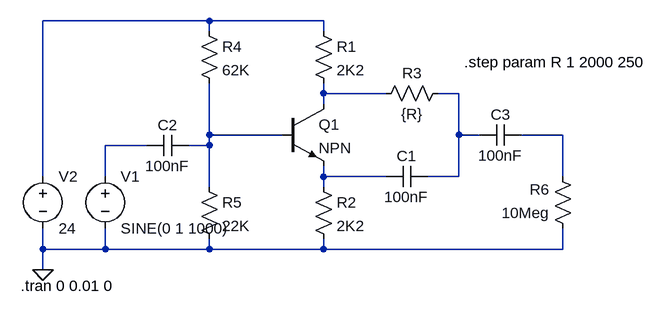
[diagram p0: schematic phase_shift_bjt_rc.asc]
phase_shift_bjt_rc.asc, the LTspice schematic file:
Version 4
SHEET 1 880 680
WIRE 32 0 -224 0
WIRE 208 0 32 0
WIRE 32 16 32 0
WIRE 208 16 208 0
WIRE 208 112 208 96
WIRE 304 112 208 112
WIRE 416 112 384 112
WIRE 208 128 208 112
WIRE 32 176 32 96
WIRE 144 176 32 176
WIRE 416 176 416 112
WIRE 448 176 416 176
WIRE 576 176 512 176
WIRE -64 192 -128 192
WIRE 32 192 32 176
WIRE 32 192 0 192
WIRE -224 240 -224 0
WIRE -128 240 -128 192
WIRE 208 240 208 224
WIRE 304 240 208 240
WIRE 416 240 416 176
WIRE 416 240 368 240
WIRE 576 240 576 176
WIRE 32 256 32 192
WIRE 208 256 208 240
WIRE -224 352 -224 320
WIRE -128 352 -128 320
WIRE -128 352 -224 352
WIRE 32 352 32 336
WIRE 32 352 -128 352
WIRE 208 352 208 336
WIRE 208 352 32 352
WIRE 576 352 576 320
WIRE 576 352 208 352
WIRE -224 384 -224 352
FLAG -224 384 0
SYMBOL npn 144 128 R0
SYMATTR InstName Q1
SYMBOL res 192 0 R0
SYMATTR InstName R1
SYMATTR Value 2K2
SYMBOL res 192 240 R0
SYMATTR InstName R2
SYMATTR Value 2K2
SYMBOL res 400 96 R90
WINDOW 0 0 56 VBottom 2
WINDOW 3 32 56 VTop 2
SYMATTR InstName R3
SYMATTR Value {R}
SYMBOL cap 368 224 R90
WINDOW 0 0 32 VBottom 2
WINDOW 3 32 32 VTop 2
SYMATTR InstName C1
SYMATTR Value 100nF
SYMBOL res 16 0 R0
SYMATTR InstName R4
SYMATTR Value 62K
SYMBOL res 16 240 R0
SYMATTR InstName R5
SYMATTR Value 22K
SYMBOL cap 0 176 R90
WINDOW 0 0 32 VBottom 2
WINDOW 3 32 32 VTop 2
SYMATTR InstName C2
SYMATTR Value 100nF
SYMBOL voltage -128 224 R0
WINDOW 123 0 0 Left 2
WINDOW 39 0 0 Left 2
SYMATTR InstName V1
SYMATTR Value SINE(0 1 1000)
SYMBOL voltage -224 224 R0
WINDOW 123 0 0 Left 2
WINDOW 39 0 0 Left 2
SYMATTR InstName V2
SYMATTR Value 24
SYMBOL cap 512 160 R90
WINDOW 0 0 32 VBottom 2
WINDOW 3 32 32 VTop 2
SYMATTR InstName C3
SYMATTR Value 100nF
SYMBOL res 592 336 R180
WINDOW 0 36 76 Left 2
WINDOW 3 36 40 Left 2
SYMATTR InstName R6
SYMATTR Value 10Meg
TEXT -258 408 Left 2 !.tran 0 0.01 0
TEXT 424 64 Left 2 !.step param R 1 2000 250

The netlist it stands for:
* phase_shift_bjt_rc.asc
Q1 N002 N004 N007 0 NPN
R1 N001 N002 2K2
R2 N007 0 2K2
R3 N003 N002 {R}
C1 N003 N007 100nF
R4 N001 N004 62K
R5 N004 0 22K
C2 N004 N006 100nF
V1 N006 0 SINE(0 1 1000)
V2 N001 0 24
C3 N005 N003 100nF
R6 0 N005 10Meg
.model NPN NPN
.model PNP PNP
.lib standard.bjt
.tran 0 0.01 0
.step param R 1 2000 250
.backanno
.end